# EAGLE design LazuriteBLE_rev1 (EAGLE 7.6.0)
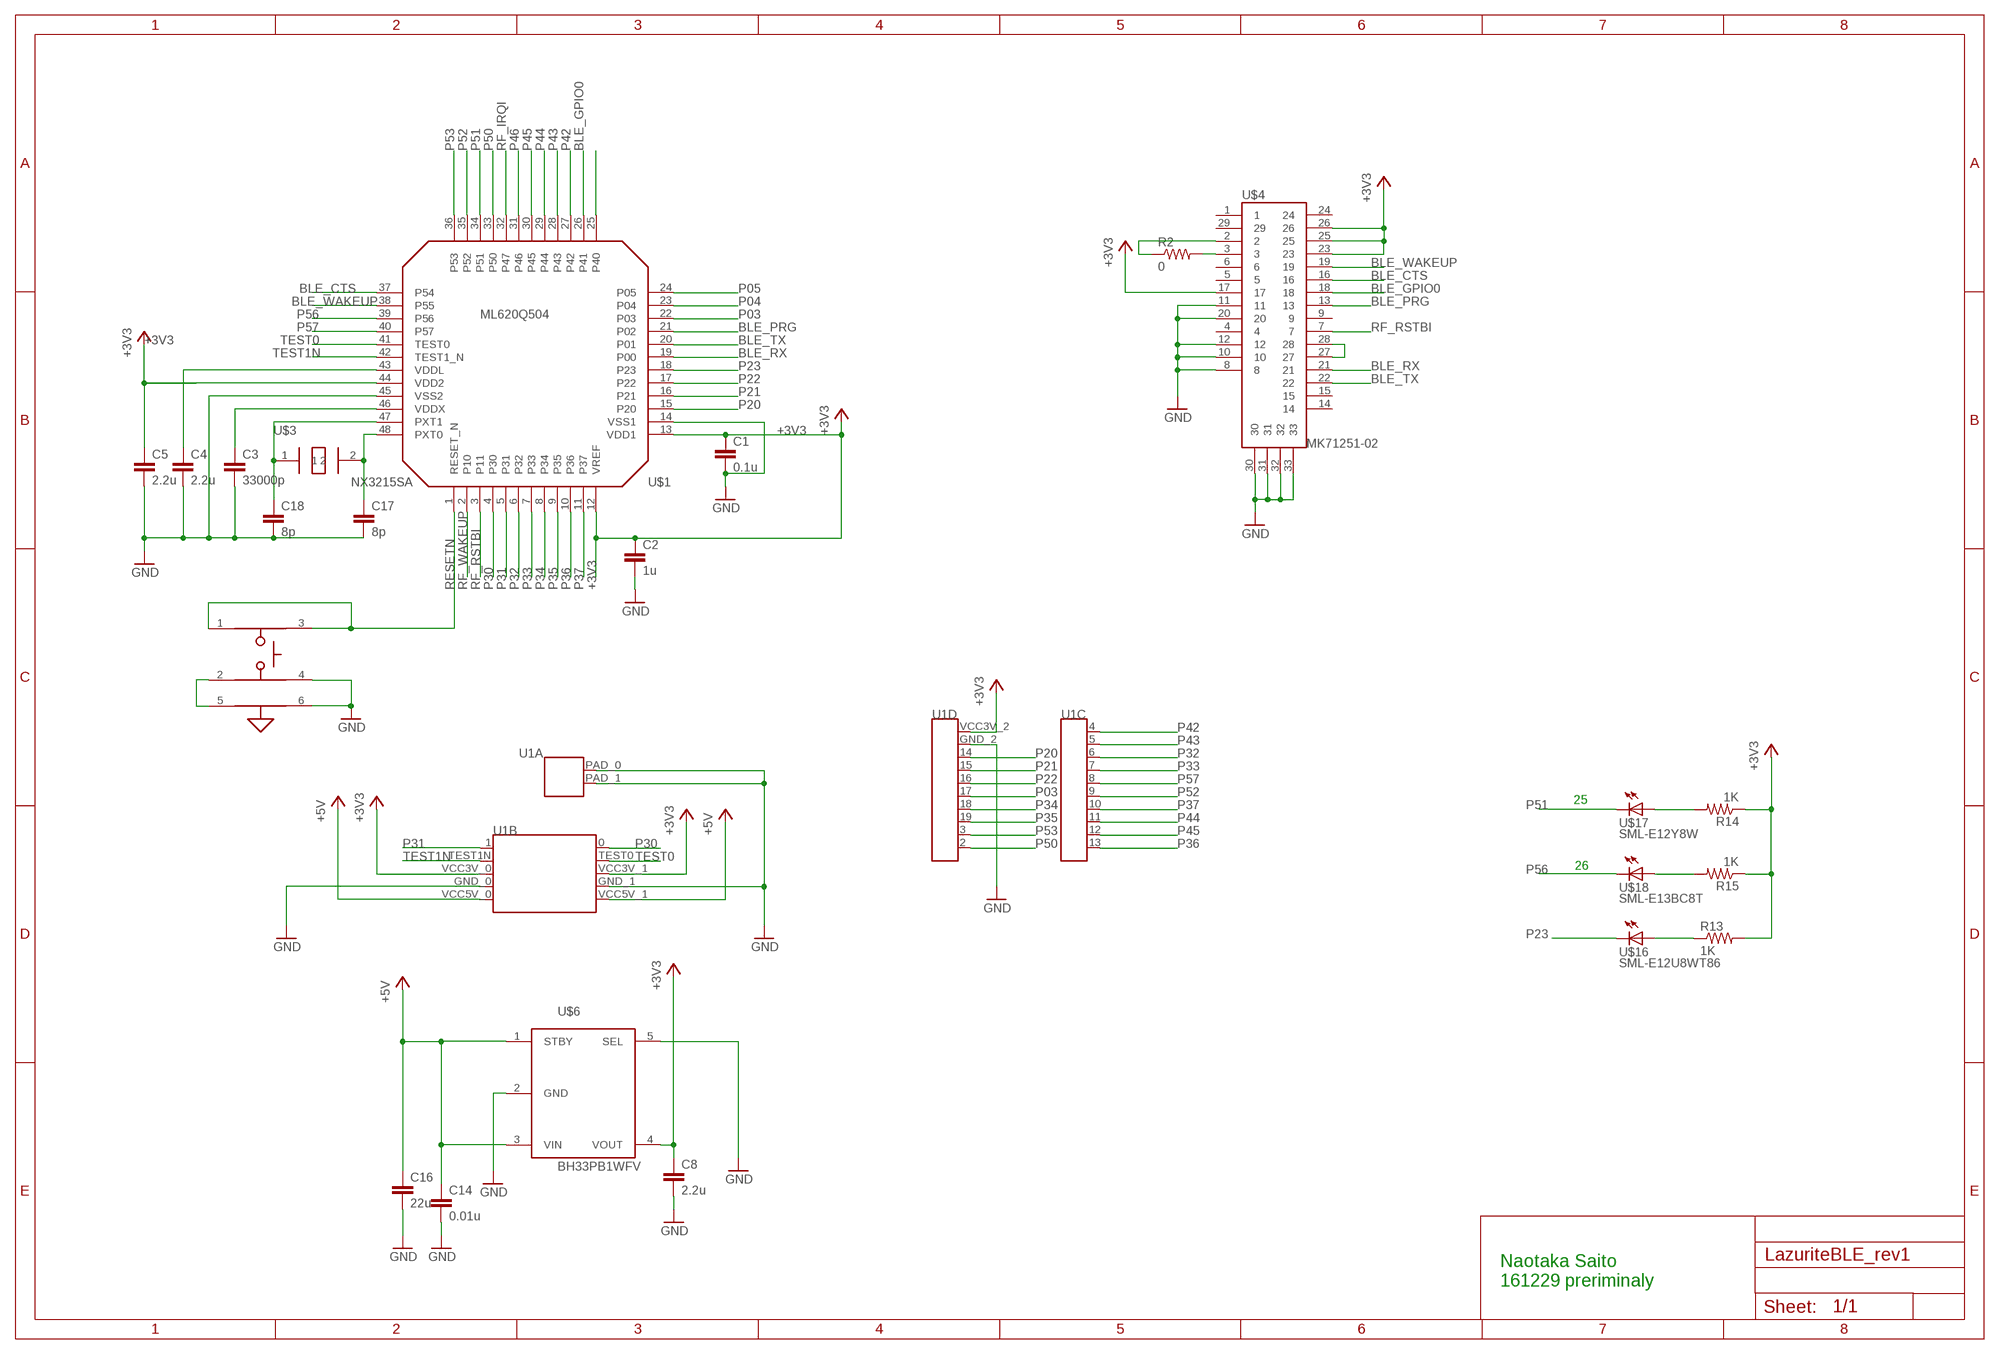
[diagram p0: schematic, sheet 1]

## Parts
C1  0.1u  C-EUC0402  [C0402]
C2  1u  C-EUC0402  [C0402]
C3  33000p  C-EUC0402  [C0402]
C4  2.2u  C-EUC0402  [C0402]
C5  2.2u  C-EUC0402  [C0402]
C8  2.2u  C-EUC0402  [C0402]
C14  0.01u  C-EUC0402  [C0402]
C16  22u  C-EUC1206  [C1206]
C17  8p  C-EUC0402  [C0402]
C18  8p  C-EUC0402  [C0402]
R2  0  R-US_R0402  [R0402]
R13  1K  R-US_R0402  [R0402]
R14  1K  R-US_R0402  [R0402]
R15  1K  R-US_R0402  [R0402]
SW1  SKSGACE010  [SKSGACE010]
U1  LAZURITE920J  [LAZURITE920J2]
U$1  ML620Q504  [ML620Q504]
U$3  NX3215SA  [NX3215SA-32,768K-SFD-MUA-14]
U$4  MK71251-02  [MK71251-02]
U$6  BH33PB1WFV  BHXXPB1WFV  [HVSOF5]
U$16  SML-E12U8WT86  SML-E1X  [SML-E1X]
U$17  SML-E12Y8W  SML-E1X  [SML-E1X]
U$18  SML-E13BC8T  SML-E1X  [SML-E1X]

## Nets
+3V3: C1.1 C2.1 C5.1 C8.1 R13.2 R14.1 R15.1 U1.VCC3V_0(B:VCC3V_0) U1.VCC3V_1(B:VCC3V_1) U1.VCC3V_2(D:VCC3V_2) U$1.12(VREF) U$1.13(VDD1) U$1.44(VDD2) U$4.17 U$4.23 U$4.25 U$4.26 U$6.4(VOUT)
+5V: C14.1 C16.1 U1.VCC5V_0(B:VCC5V_0) U1.VCC5V_1(B:VCC5V_1) U$6.1(STBY) U$6.3(VIN)
BLE_CTS: U$1.37(P54) U$4.16
BLE_GPIO0: U$1.26(P41) U$4.18
BLE_PRG: U$1.21(P02) U$4.13
BLE_RX: U$1.19(P00) U$4.21
BLE_TX: U$1.20(P01) U$4.22
BLE_WAKEUP: U$1.38(P55) U$4.19
GND: C1.2 C2.2 C3.2 C4.2 C5.2 C8.2 C14.2 C16.2 C17.2 C18.2 SW1.4 SW1.6 U1.GND_0(B:GND_0) U1.GND_1(B:GND_1) U1.GND_2(D:GND_2) U1.PAD_0(A:PAD_0) U1.PAD_1(A:PAD_1) U$1.14(VSS1) U$1.45(VSS2) U$4.8 U$4.10 U$4.11 U$4.12 U$4.20 U$4.30 U$4.31 U$4.32 U$4.33 U$6.2(GND) U$6.5(SEL)
N$1: C17.1 U$1.48(PXT0) U$3.2
N$2: C18.1 U$1.47(PXT1) U$3.1
N$3: C3.1 U$1.46(VDDX)
N$4: R2.2 U$4.3
N$5: R14.2 U$17.A
N$7: C4.1 U$1.43(VDDL)
N$11: SW1.2 SW1.5
N$19: R13.1 U$16.A
N$22: R15.2 U$18.A
N$32: R2.1 U$4.2
N$33: U$4.27 U$4.28
P03: U1.17 U$1.22(P03)
P04: U$1.23(P04)
P05: U$1.24(P05)
P20: U1.14 U$1.15(P20)
P21: U1.15 U$1.16(P21)
P22: U1.16 U$1.17(P22)
P23: U$1.18(P23) U$16.C
P30: U1.0 U$1.4(P30)
P31: U1.1 U$1.5(P31)
P32: U1.6 U$1.6(P32)
P33: U1.7 U$1.7(P33)
P34: U1.18 U$1.8(P34)
P35: U1.19 U$1.9(P35)
P36: U1.13 U$1.10(P36)
P37: U1.10 U$1.11(P37)
P42: U1.4 U$1.27(P42)
P43: U1.5 U$1.28(P43)
P44: U1.11 U$1.29(P44)
P45: U1.12 U$1.30(P45)
P46: U$1.31(P46)
P50: U1.2 U$1.33(P50)
P51: U$1.34(P51) U$17.C
P52: U1.9 U$1.35(P52)
P53: U1.3 U$1.36(P53)
P56: U$1.39(P56) U$18.C
P57: U1.8 U$1.40(P57)
RESETN: SW1.1 SW1.3 U$1.1(RESET_N)
RF_IRQI: U$1.32(P47)
RF_RSTBI: U$1.3(P11) U$4.7
RF_WAKEUP: U$1.2(P10)
SDA0I: U$1.25(P40)
TEST0: U1.TEST0(B:TEST0) U$1.41(TEST0)
TEST1N: U1.TEST1N(B:TEST1N) U$1.42(TEST1_N)
Unconnected: U$4.1 U$4.4 U$4.5 U$4.6 U$4.9 U$4.14 U$4.15 U$4.24 U$4.29

## Notes on the sheet
- 25
- 26
- Naotaka Saito
  161229 preriminaly

## Library data of the parts
C1-C5 C8 C14 C16-C18 = rcl:C-EU: CAPACITOR, European symbol
R2 R13-R15 = rcl:R-US_: RESISTOR, American symbol
SW1 = lz-shield:SKSGACE010
U1 = lazurite:LAZURITE920J: Lazurite 920J
U$1 = lazurite:ML620Q504
U$3 = lazurite:NX3215SA
U$4 = lz-shield:MK71251-02
U$6 = lazurite:BHXXPB1WFV
U$16-U$18 = lazurite:SML-E1X

## Board
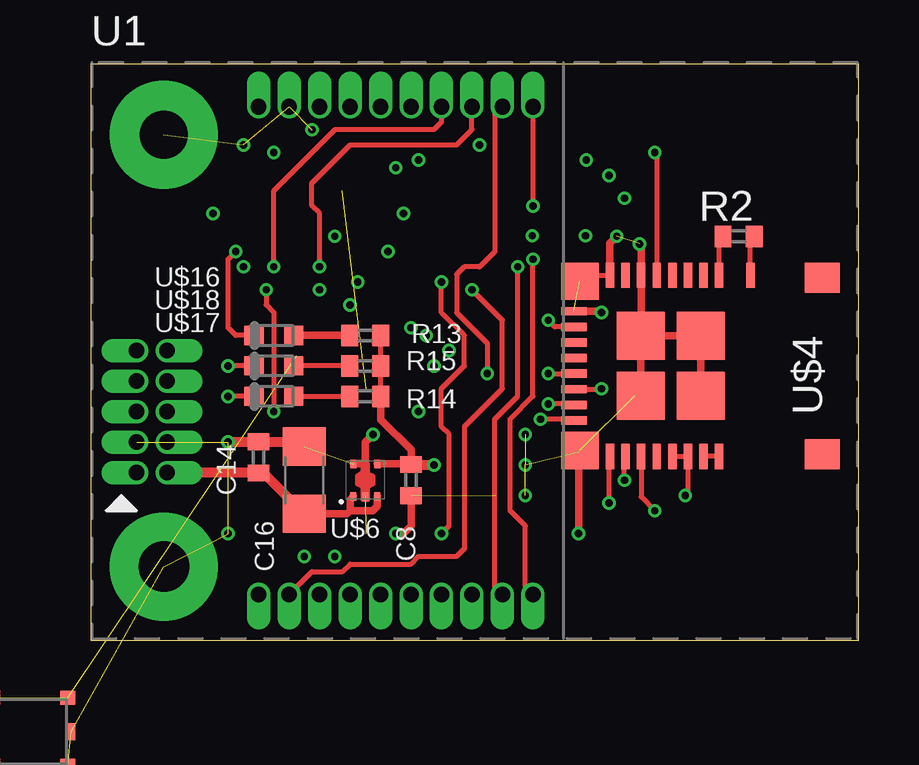
[diagram p1: board, top side]
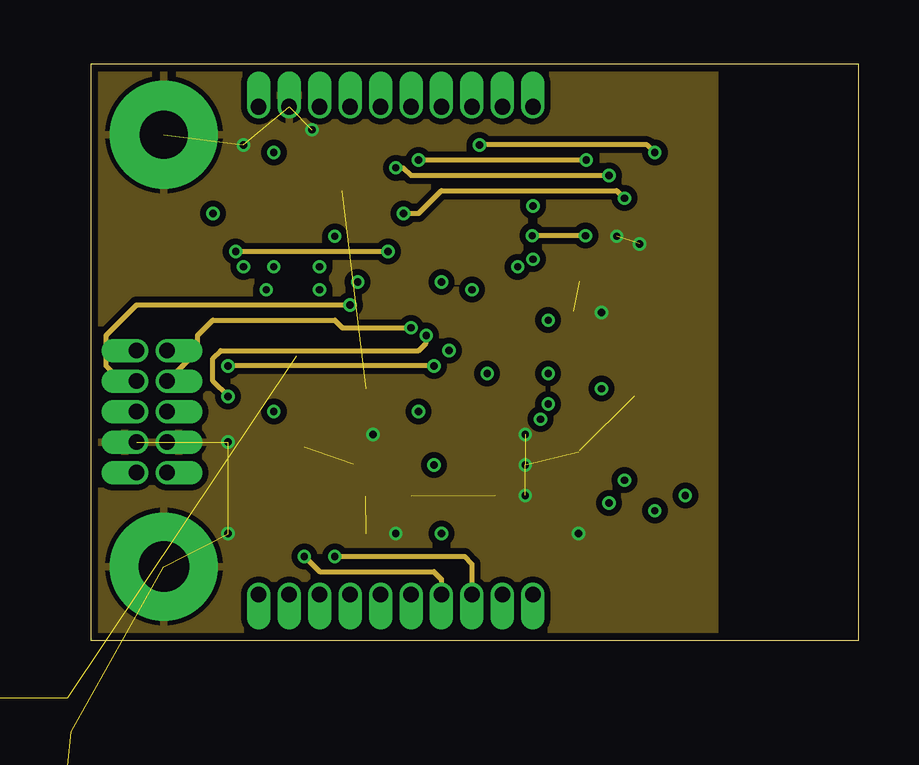
[diagram p2: board, inner layer Route2]
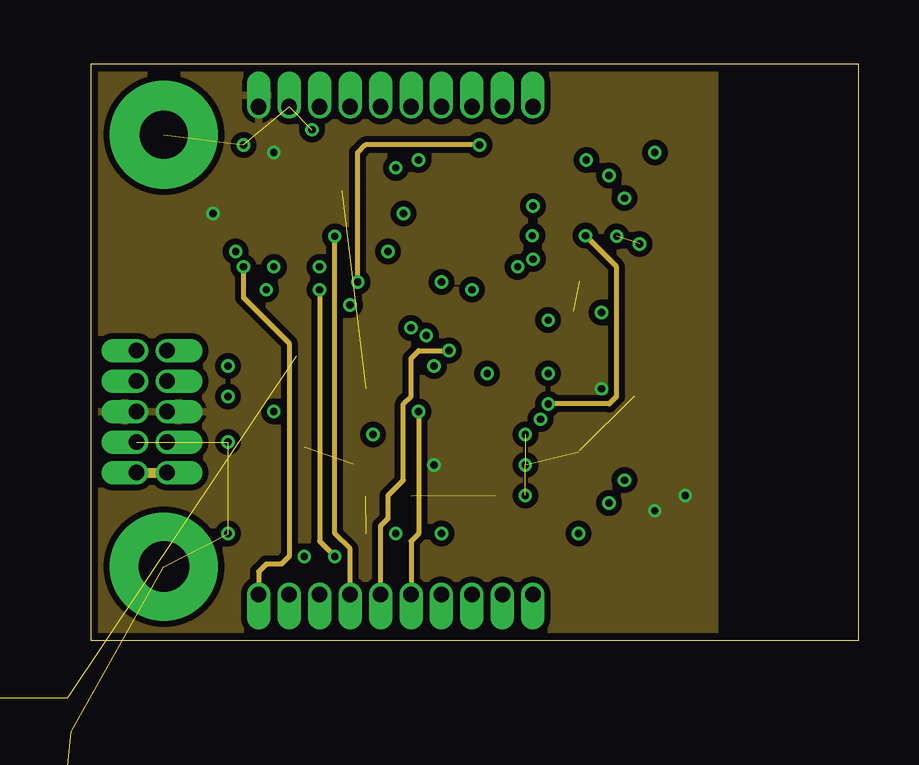
[diagram p3: board, inner layer Route3]
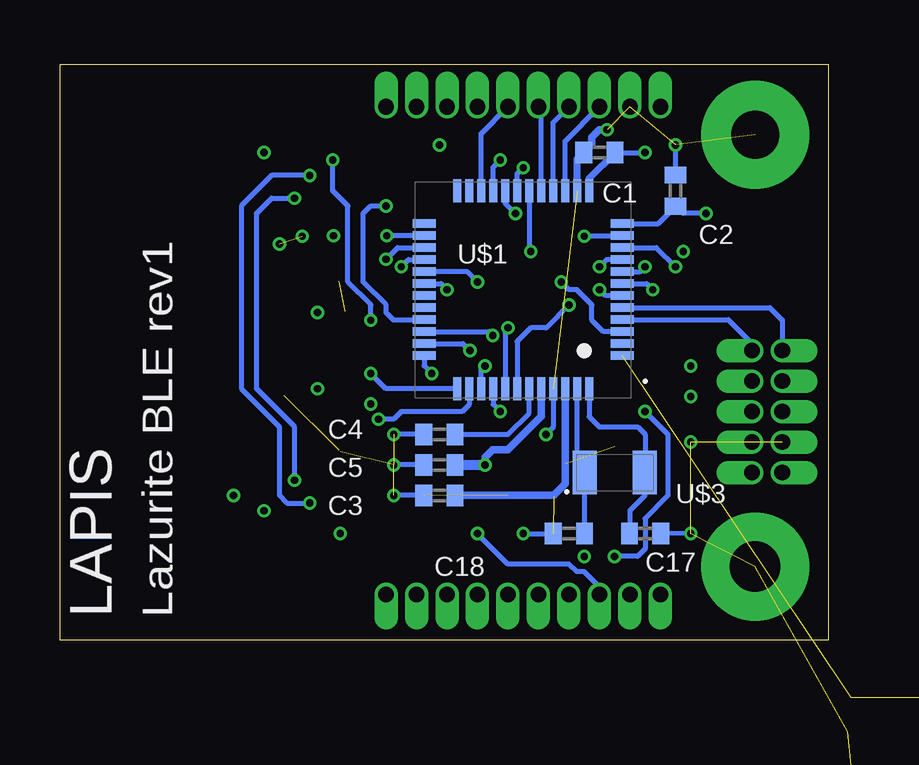
[diagram p4: board, bottom side, seen from below]

Size 32 x 24 mm. Coordinates in mm from the lower left corner, seen from the top.
Outline: 0,0 32,0 32,24 0,24 0,0
Copper layers (1+2*3+16): Top 0.018mm / dielectric 0.36mm / Route2 0.035mm / dielectric 0.71mm / Route3 0.035mm / dielectric 0.36mm / Bottom 0.018mm
Design rules "unicraft_4_layer": minimum track width 0.125mm, minimum drill 0.3mm, track to track 0.125mm, track to pad 0.125mm, pad to pad 0.125mm, via to via 0.125mm, smd to smd 0mil, copper to edge 0.3mm, drill to drill 0.2mm, minimum pad ring 0.125mm, minimum via ring 0.125mm, stop-mask expansion 2mil, vias tented up to drill 0.45mm, thermal gap 0.2mm

### Footprints (pad centres in the part's own frame; a part is rotated, then mirrored left to right if it is on the bottom)
C0402 = smd 0.7 x 0.9: 1 -0.65,0; 2 0.65,0
C1206 = smd 1.6 x 1.8: 1 -1.4,0; 2 1.4,0
R0402 = smd 0.7 x 0.9: 1 -0.65,0; 2 0.65,0
SKSGACE010 = smd 0.625 x 0.575: 1 -1.562,1.413; 2 -1.562,-1.413; 3 1.562,1.413; 4 1.562,-1.413 | smd 0.325 x 0.7: 5 -1.712,0; 6 1.712,0
LAZURITE920J2 = drill 0.65 pad 0.8 offset: 0 1.27,5.08; 1 0,5.08; 2 16.51,15.24; 3 15.24,15.24; 4 16.51,-5.08; 5 15.24,-5.08; 6 13.97,-5.08; 7 12.7,-5.08; 8 11.43,-5.08; 9 10.16,-5.08; 10 8.89,-5.08; 11 7.62,-5.08; 12 6.35,-5.08; 13 5.08,-5.08; 14 7.62,15.24; 15 8.89,15.24; 16 10.16,15.24; 17 11.43,15.24; 18 12.7,15.24; 19 13.97,15.24; GND_0 0,1.27; GND_1 1.27,1.27; GND_2 6.35,15.24; TEST0 1.27,3.81; TEST1N 0,3.81; VCC3V_0 0,2.54; VCC3V_1 1.27,2.54; VCC3V_2 5.08,15.24; VCC5V_0 0,0; VCC5V_1 1.27,0 | drill 2.1 pad 4.5: PAD_0 1.135,-3.92 | drill 2 pad 4.5: PAD_1 1.135,14.08
ML620Q504 = smd 0.35 x 0.95: 1 -2.75,-4.125; 2 -2.25,-4.125; 3 -1.75,-4.125; 4 -1.25,-4.125; 5 -0.75,-4.125; 6 -0.25,-4.125; 7 0.25,-4.125; 8 0.75,-4.125; 9 1.25,-4.125; 10 1.75,-4.125; 11 2.25,-4.125; 12 2.75,-4.125; 25 2.75,4.125; 26 2.25,4.125; 27 1.75,4.125; 28 1.25,4.125; 29 0.75,4.125; 30 0.25,4.125; 31 -0.25,4.125; 32 -0.75,4.125; 33 -1.25,4.125; 34 -1.75,4.125; 35 -2.25,4.125; 36 -2.75,4.125 | smd 0.95 x 0.35: 13 4.125,-2.75; 14 4.125,-2.25; 15 4.125,-1.75; 16 4.125,-1.25; 17 4.125,-0.75; 18 4.125,-0.25; 19 4.125,0.25; 20 4.125,0.75; 21 4.125,1.25; 22 4.125,1.75; 23 4.125,2.25; 24 4.125,2.75; 37 -4.125,2.75; 38 -4.125,2.25; 39 -4.125,1.75; 40 -4.125,1.25; 41 -4.125,0.75; 42 -4.125,0.25; 43 -4.125,-0.25; 44 -4.125,-0.75; 45 -4.125,-1.25; 46 -4.125,-1.75; 47 -4.125,-2.25; 48 -4.125,-2.75
NX3215SA-32,768K-SFD-MUA-14 = smd 1 x 1.8: 1 -1.25,0; 2 1.25,0
MK71251-02 = smd 1.25 x 1.45: 1 -3.675,5.075; 29 3.675,5.075 | smd 1.05 x 0.35: 2 -3.775,2.075; 3 -3.775,0.775; 4 -3.775,0.125; 5 -3.775,-0.525; 6 -3.775,-1.175; 7 -3.775,-1.825; 8 -3.775,-2.475; 9 -3.775,-3.125; 10 -3.775,-3.775; 21 3.775,-3.775; 22 3.775,-3.125; 23 3.775,-2.475; 24 3.775,-1.825; 25 3.775,-1.175; 26 3.775,-0.525; 27 3.775,0.125; 28 3.775,0.775 | smd 1.55 x 1.55: 11 -3.525,-5.025; 20 3.525,-5.025 | smd 0.35 x 1.05: 12 -2.275,-5.275; 13 -1.625,-5.275; 14 -0.975,-5.275; 15 -0.325,-5.275; 16 0.325,-5.275; 17 0.975,-5.275; 18 1.625,-5.275; 19 2.275,-5.275 | smd 2 x 2: 30 -1.25,0; 31 -1.25,-2.5; 32 1.25,-2.5; 33 1.25,0
HVSOF5 = smd 0.25 x 0.35: 1 0.5,0.675; 2 0,0.675; 3 -0.5,0.675; 4 -0.5,-0.675; 5 0.5,-0.675
SML-E1X = smd 0.8 x 0.8: A 0,-0.825; C 0,0.825

### Placement (x,y rotation side)
C1  9.53,20.32 180 bottom
C2  6.35,18.73 90 bottom
C3  16.19,6.03 180 bottom
C4  16.19,8.57 180 bottom
C5  16.19,7.3 180 bottom
C8  13.34,6.67 270 top
C14  6.99,7.62 90 top
C16  8.89,6.67 90 top
C17  7.62,4.45 0 bottom
C18  10.79,4.45 180 bottom
R2  26.99,16.83 180 top
R13  11.43,12.7 0 top
R14  11.43,10.16 180 top
R15  11.43,11.43 180 top
SW1  -2.54,-3.81 0 top
U1  1.91,6.99 0 top
U$1  12.7,14.61 90 bottom
U$3  8.89,6.99 0 bottom
U$4  25.4,11.43 270 top
U$6  11.43,6.67 180 top
U$16  7.62,12.7 90 top
U$17  7.62,10.16 90 top
U$18  7.62,11.43 90 top

### Tracks (layer width: path | path; a pad name or v marks a point on that pad's centre or on a via)
+3V3  (via drill 0.3)
  Top 0.203: R14.1 R15.1 R13.2 | U$4.17 21.25,10.46 v21.27,10.48 | U$4.23 22.93,5.97 v23.5,5.4 | v24.77,6.03 24.88,6.14 U$4.26 U$4.25
  Top 0.305: U$6.4 13.31,7.34 C8.1 13.34,7.94 12.08,9.19 R14.1 | U$4.17 20.1,10.48
  Top 0.406: C8.1 13.35,7.3 v14.29,7.3
  Bottom 0.2: C1.1 v7.62,20.32 | U$1.12
  Bottom 0.203: U$1.12 7.08,17.36 C2.1 6.05,17.78 v5.08,17.78
  Bottom 0.3: C1.1 9.95,19.25 U$1.13
  Bottom 0.305: v14.29,7.3 14.29,7.62 13.97,7.94 13.34,7.94 11.95,9.32 U$1.44
  Bottom 0.406: C5.1 v14.29,7.3
  pour Route3 (isolate 0.254): 0,24 26,24 26,0 0,0
+5V
  Top 0.305: C16.1 10.66,5.27 10.79,5.4 | 10.79,5.4 10.79,5.86 U$6.1 | U$6.3 11.93,5.58 11.75,5.4 10.79,5.4
  Top 0.406: U1.VCC5V_1 3.19,6.97 C14.1 7.19,6.97 C16.1
  Route3 0.406: U1.VCC5V_0 U1.VCC5V_1
BLE_CTS  (via drill 0.3)
  Top 0.203: v19.05,11.11 U$4.16
  Bottom 0.203: U$1.37 18.42,10.48 v19.05,11.11
BLE_GPIO0  (via drill 0.3)
  Top 0.203: U$4.18 20.09,9.84 v19.05,9.84
  Route2 0.203: v20.61,16.86 v18.39,16.86
  Route3 0.203: v20.61,16.86 21.91,15.56 21.91,10.16 21.59,9.84 v19.05,9.84
  Bottom 0.203: U$1.26 v18.39,16.86
BLE_PRG  (via drill 0.3)
  Top 0.203: U$4.13 19.33,13.05 v19.05,13.34
  Route2 0.203: v20.64,20 v13.65,20
  Bottom 0.203: U$1.21 13.95,19.7 v13.65,20 | v19.05,13.34 19.05,13.97 20,14.92 20,18.1 20.64,18.73 v20.64,20
BLE_RX  (via drill 0.3)
  Top 0.203: v21.59,5.71 21.59,7.62 U$4.21
  Route2 0.203: v12.7,19.68 13.02,19.68 13.34,19.37 v21.59,19.37
  Bottom 0.203: U$1.19 12.95,19.43 v12.7,19.68 | v21.59,19.37 23.18,19.37 24.45,18.1 24.45,10.48 22.86,8.89 22.86,6.03 22.54,5.71 v21.59,5.71
BLE_TX  (via drill 0.3)
  Top 0.203: v22.23,6.67 22.23,7.61 U$4.22
  Route2 0.203: v13.02,17.78 13.65,17.78 14.61,18.73 21.91,18.73 v22.23,18.41
  Bottom 0.203: U$1.20 13.45,18.21 v13.02,17.78 | v22.23,6.67 22.23,8.89 23.81,10.48 23.81,17.78 23.18,18.41 v22.23,18.41
BLE_WAKEUP  (via drill 0.3)
  Top 0.203: U$4.19 20.07,9.21 v18.73,9.21
  Bottom 0.203: U$1.38 14.95,9.81 15.24,9.53 17.78,9.53 18.1,9.21 v18.73,9.21
GND  (via drill 0.3)  (19 unrouted)
  Top 0.203: 20.62,15.21 U$4.10
  Top 0.305: v11.75,8.57 11.43,8.26 11.43,7.3 | 11.43,7.3 U$6.2 | U$6.5 11.39,7.34 11.43,7.3 | v12.7,4.45 13.02,4.45 13.34,4.76 C8.2 | U$4.12 21.22,13.71 v21.27,13.65 | U$4.11 20.62,15.21 | 22.93,12.71 U$4.31 U$4.32 | 22.93,12.71 U$4.8 22.93,16.45 v22.86,16.51 | 22.93,12.71 22.95,12.68 U$4.30 U$4.33 | U$4.32 22.92,10.16 | 22.65,10.18 U$4.32 | U$4.20 20.32,7.85 v20.32,4.45 | U$4.10 21.62,16.55 v21.91,16.83
  Top 0.406: C16.2 8.69,8.27 C14.2 6.97,8.26 v5.71,8.26
  Bottom 0.203: v12.7,4.45 C18.2 | v5.71,4.45 6.99,4.46 C17.2 | C3.2 v18.1,6.03 | C5.2 v18.1,7.3 | C4.2 v18.1,8.57 | C2.2 v6.35,20.64 | U$1.45 11.45,8.87 v11.75,8.57
  Bottom 0.3: U$1.14 10.45,20.05 C1.2 10.16,20.32
  Bottom 0.305: 10.16,20.32 9.84,20.64 9.84,20.95 9.53,21.27 v9.21,21.27
  pour Route2 (isolate 0.254): 0,24 26,24 26,0 0,0
N$1
  Bottom 0.203: U$1.48 9.95,9.31 9.53,8.89 7.94,8.89 7.62,8.57 7.62,7 U$3.2 7.64,6.01 8.26,5.4 8.26,4.46 C17.1
N$2
  Bottom 0.203: C18.1 U$3.1 10.45,7.29 U$1.47
N$3
  Bottom 0.305: U$1.46 10.95,6.51 11.43,6.03 C3.1
N$4
  Top 0.2: U$4.3 26.18,16.66 R2.2
N$5
  Top 0.203: U$17.A R14.2
N$7
  Bottom 0.203: C4.1 13.34,8.57 12.45,9.46 U$1.43
N$11  (1 unrouted)
N$19
  Top 0.305: R13.1 U$16.A
N$22
  Top 0.203: R15.2 U$18.A
N$32
  Top 0.2: U$4.2 27.48,16.66 R2.1
N$33
  Top 0.203: U$4.28 U$4.27
P03
  Bottom 0.2: U$1.22 14.45,21.11 U1.17
P20
  Bottom 0.2: U$1.15 10.95,20.8 U1.14
P21
  Bottom 0.2: U$1.16 11.45,21.57 U1.15
P22
  Bottom 0.2: U$1.17 11.95,22.11 U1.16
P23  (via drill 0.3)
  Top 0.203: U$16.C 6.03,12.7 5.71,13.02 5.71,15.88 v6.03,16.19
  Route2 0.203: v12.38,16.19 v6.03,16.19
  Bottom 0.203: U$1.18 12.45,16.26 v12.38,16.19
P30
  Bottom 0.203: U$1.4 4.15,13.36 3.17,12.38 U1.0
P31
  Bottom 0.203: U$1.5 2.42,13.86 1.91,13.34 U1.1
P32  (via drill 0.3)
  Route2 0.203: v10.16,3.49 15.56,3.49 15.88,3.17 U1.6
  Route3 0.203: v10.16,3.49 9.53,4.13 v9.53,14.61
  Bottom 0.203: U$1.6 9.28,14.36 v9.53,14.61
P33  (via drill 0.3)
  Top 0.203: v7.3,14.61 7.3,13.97 7.62,13.65 v7.62,9.53
  Route2 0.203: v8.89,3.49 9.53,2.86 14.29,2.86 14.61,2.54 U1.7
  Bottom 0.203: U$1.7 7.55,14.86 v7.3,14.61 | v7.62,9.53 6.67,8.57 6.67,6.03 7.62,5.08 7.62,3.81 7.94,3.49 v8.89,3.49
P34  (via drill 0.3)
  Top 0.203: v7.62,15.56 7.62,18.73 10.16,21.27 14.29,21.27 14.61,21.59 U1.18
  Bottom 0.203: U$1.8 7.82,15.36 v7.62,15.56
P35  (via drill 0.3)
  Top 0.203: U1.19 15.88,21.27 15.24,20.64 10.79,20.64 9.21,19.05 9.21,18.1 9.53,17.78 v9.53,15.56
  Bottom 0.203: U$1.9 9.23,15.86 v9.53,15.56
P36  (via drill 0.3)
  Route3 0.203: v6.35,15.56 6.35,14.29 8.26,12.38 8.26,3.49 7.94,3.17 7.3,3.17 6.99,2.86 U1.13
  Bottom 0.203: U$1.10 7.15,16.36 v6.35,15.56
P37  (via drill 0.3)
  Route3 0.203: U1.10 10.79,3.81 10.16,4.45 v10.16,16.83
  Bottom 0.203: v10.16,16.83 10.13,16.86 U$1.11
P42  (via drill 0.3)
  Top 0.203: U1.4 18.1,2.22 18.1,4.76 17.46,5.4 17.46,9.21 18.41,10.16 v18.41,15.88
  Bottom 0.203: v18.41,15.88 17.93,16.36 U$1.27
P43  (via drill 0.3)
  Top 0.203: U1.5 16.83,2.22 16.83,9.21 17.78,10.16 v17.78,15.56
  Bottom 0.203: v17.78,15.56 17.48,15.86 U$1.28
P44  (via drill 0.3)
  Top 0.203: v14.61,14.92 14.61,13.65 15.56,12.7 15.56,11.43 14.61,10.48 14.61,8.89 14.92,8.57 14.92,4.76 v14.61,4.45
  Bottom 0.203: U1.11 9.53,2.22 10.16,2.86 10.48,2.86 10.79,3.17 13.34,3.17 v14.61,4.45 | U$1.29 15.04,15.36 v14.61,14.92
P45  (via drill 0.3)
  Top 0.203: U1.12 9.21,2.86 10.48,2.86 10.79,3.17 13.34,3.17 13.65,3.49 15.24,3.49 15.56,3.81 15.56,8.89 17.14,10.48 17.14,13.34 v15.88,14.61
  Bottom 0.203: U$1.30 16.12,14.86 v15.88,14.61
P50  (via drill 0.3)
  Top 0.203: U1.2 v18.41,18.1
  Bottom 0.203: U$1.33 16.84,13.34 18.1,13.34 18.41,13.65 18.41,13.97 19.37,14.92 19.37,17.78 19.05,18.1 v18.41,18.1
P51  (via drill 0.3)
  Top 0.203: U$17.C v5.71,10.16
  Route2 0.203: v5.71,10.16 5.08,10.79 5.08,11.75 5.4,12.06 13.65,12.06 13.97,12.38 v13.97,12.7
  Bottom 0.203: U$1.34 14.12,12.86 v13.97,12.7
P52  (via drill 0.3)
  Route3 0.203: U1.9 12.06,4.76 12.38,5.08 12.38,6.03 13.02,6.67 13.02,9.84 13.34,10.16 13.34,11.75 13.65,12.06 v14.92,12.06
  Bottom 0.203: U$1.35 15.21,12.36 v14.92,12.06
P53  (via drill 0.3)
  Top 0.203: U1.3 16.83,21.91 16.83,16.19 16.19,15.56 15.56,15.56 15.24,15.24 15.24,13.65 16.51,12.38 v16.51,11.11
  Bottom 0.203: U$1.36 16.82,11.43 v16.51,11.11
P56  (via drill 0.3)
  Top 0.203: U$18.C v5.71,11.43
  Route2 0.203: v14.29,11.43 v5.71,11.43
  Bottom 0.203: U$1.39 14.45,11.27 v14.29,11.43
P57  (via drill 0.3)
  Route3 0.203: v13.65,9.53 13.65,4.45 13.34,4.13 U1.8
  Bottom 0.203: U$1.40 13.95,9.82 v13.65,9.53
RESETN  (2 unrouted)
RF_RSTBI  (via drill 0.3)
  Top 0.203: v23.5,20.32 23.57,20.24 U$4.7
  Route2 0.203: v23.5,20.32 23.18,20.64 v16.19,20.64
  Route3 0.203: v11.11,14.92 11.11,20.32 11.43,20.64 v16.19,20.64
  Bottom 0.203: U$1.3 9.36,12.86 9.84,13.34 9.84,13.97 10.48,14.61 10.79,14.61 v11.11,14.92
TEST0  (via drill 0.3)
  Route2 0.203: U1.TEST0 4.45,12.06 4.45,12.7 5.08,13.34 10.16,13.34 10.48,13.02 v13.34,13.02
  Bottom 0.203: v13.34,13.02 13.45,12.9 U$1.41
TEST1N  (via drill 0.3)
  Route2 0.2: U1.TEST1N 1.27,10.79
  Route2 0.203: 1.27,10.79 0.64,11.43 0.64,12.7 1.91,13.97 v10.79,13.97
  Bottom 0.203: v10.79,13.97 11.75,13.02 12.38,13.02 12.95,12.45 U$1.42

### Text on the board
bPlace: Lazurite BLE rev1 | LAPIS